# EAGLE design piezo-preamp-tickler_V3-5_single-supply-OPA1642 (EAGLE 8.2.2)

## Sheet 1 of 2
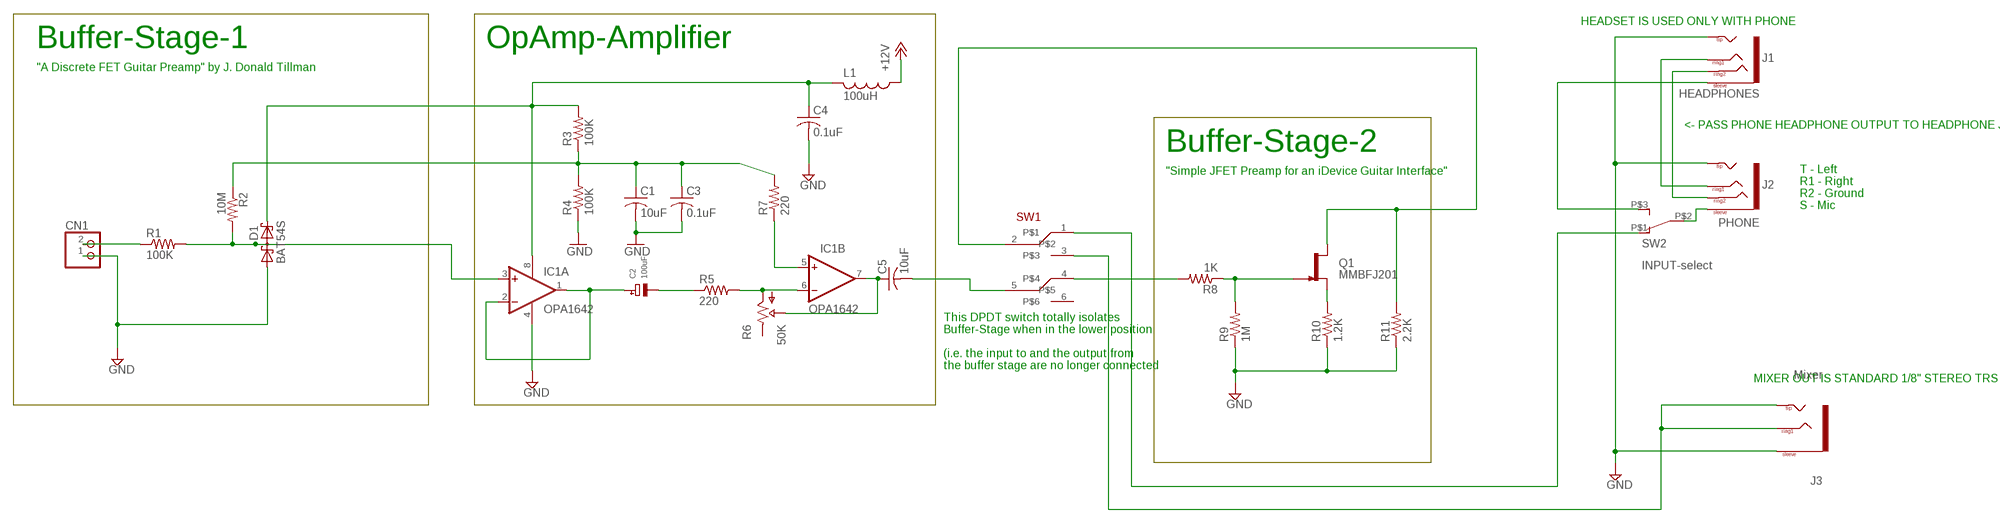
[diagram p0: schematic, sheet 1]

### Parts
C1  10uF  C-USC0805K  [C0805K]
C2  100uF  CAP_TANTALUMA/3216_REFLOW  [EIA3216-18/A-R]
C3  0.1uF  C-USC0805K  [C0805K]
C4  0.1uF  C-USC0805K  [C0805K]
C5  10uF  C-USC0805  [C0805]
CN1  JST_2PIN-THM  [JST-PH-2-THM]
D1  BAT54S  [SOT23]
IC1  OPA1642  OPA2134UA  [SO08]
J1  HEADPHONES  TRRS-1/8"-3.5MMLGPADS  [TRRS_SJ-43514-SMT-TR]
J2  PHONE  TRRS-1/8"-3.5MMLGPADS  [TRRS_SJ-43514-SMT-TR]
J3  Mixer  TRS-1/8"-3.5MM  [TRS_SJ-3524-SMT]
L1  100uH  L-USL3225P  [L3225P]
Q1  MMBFJ201  J201SOT-23  [SOT23-3]
R1  100K  R-US_R0603  [R0603]
R2  10M  R-US_R0603  [R0603]
R3  100K  R-US_R0603  [R0603]
R4  100K  R-US_R0603  [R0603]
R5  220  R-US_R0603  [R0603]
R6  50K  POTPOT-THUMB-ALPHA  [POT-THUMB-14MM_ALPHA-RV100F-30-4K1B-B10K-B301]
R7  220  R-US_R0603  [R0603]
R8  1K  R-US_R0603  [R0603]
R9  1M  R-US_R0603  [R0603]
R10  1.2K  R-US_R0603  [R0603]
R11  2.2K  R-US_R0603  [R0603]
SW1  SWITCH_DPDT  [SWITCH_DPDT_CL-SB-22B]
SW2  INPUT-select  SWITCH_SPDTCL-SB-12B  [SWITCH_SPDT_CL-SB-12B]

### Nets
+12V: L1.1 ; also sheet 2
GND: C1.2 C3.2 C4.2 CN1.1 D1.1(A1) IC1.4(A:V-) J1.TIP J2.TIP J3.1(SLEEVE) R4.1 R9.1 R10.1 R11.1 ; also sheet 2
N$2: CN1.2 R1.1
N$3: Q1.2(S) R10.2
N$4: J1.EARTH(SLEEVE)
N$5: IC1.5(B:+IN) R7.1
N$6: C5.1 IC1.7(B:OUT) R6.P$2(WIPER)
N$7: IC1.6(B:-IN) R5.2 R6.P$1(IN)
N$9: D1.3(C1A2) IC1.3(A:+IN) R1.2 R2.2
N$10: Q1.3(G) R8.1 R9.2
N$11: R8.2 SW1.4
N$12: J3.2(TIP) J3.3(RING1) J3.4(TIP) SW1.3
N$13: J1.RING1 J2.RING1
N$14: C2.- R5.1
N$15: J1.RING2 J2.RING2
N$16: C5.2 SW1.5
N$17: J2.EARTH(SLEEVE) SW2.P$2
N$19: SW1.1 SW2.P$1
N$23: C1.1 C3.1 R2.1 R3.1 R4.2 R7.2
N$24: C2.+ IC1.1(A:OUT) IC1.2(A:-IN)
N$25: C4.1 D1.2(C2) IC1.8(A:V+) L1.2 R3.2
SELECT: Q1.1(D) R11.2 SW1.2
Unconnected: R6.P$3(OUT) SW1.6 SW2.P$3

### Notes on the sheet
- HEADSET IS USED ONLY WITH PHONE
- Buffer-Stage-1 | OpAmp-Amplifier
- "A Discrete FET Guitar Preamp" by J. Donald Tillman
- <- PASS PHONE HEADPHONE OUTPUT TO HEADPHONE JACK
- Buffer-Stage-2
- "Simple JFET Preamp for an iDevice Guitar Interface"
- T - Left
  R1 - Right
  R2 - Ground
  S - Mic
- This DPDT switch totally isolates 
  Buffer-Stage when in the lower position
  
  (i.e. the input to and the output from 
  the buffer stage are no longer connected
- MIXER OUT IS STANDARD 1/8" STEREO TRS

## Sheet 2 of 2
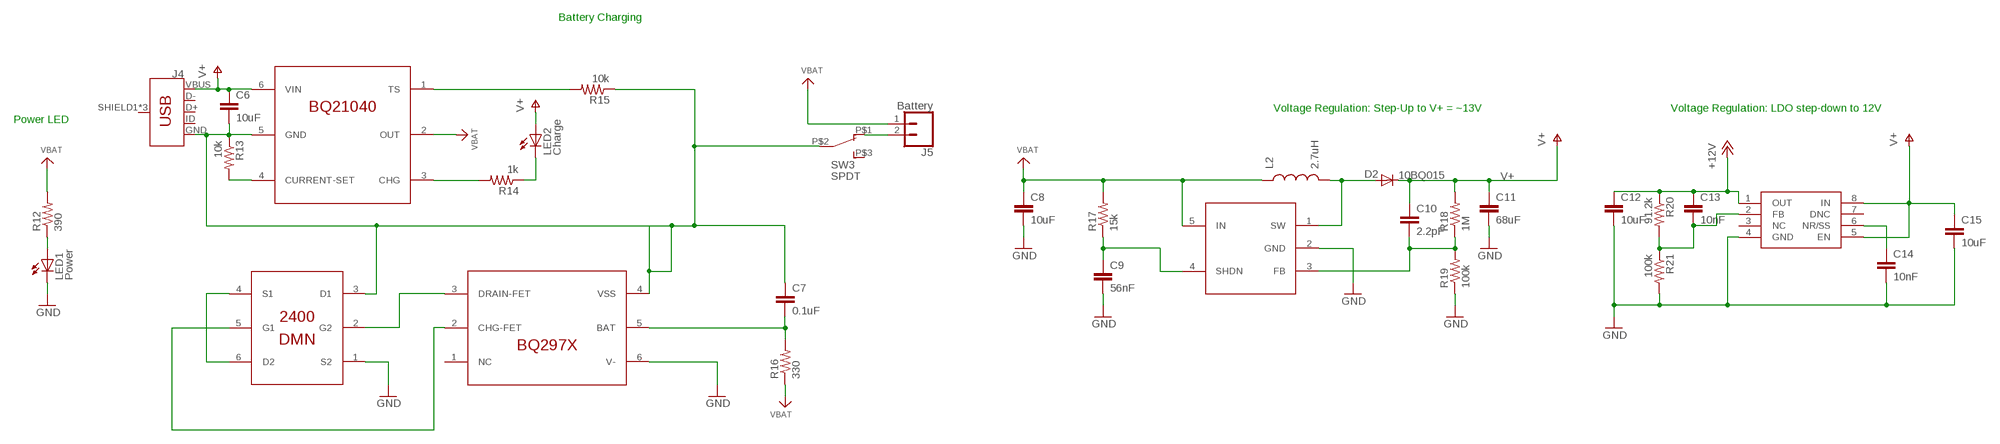
[diagram p1: schematic, sheet 2]

### Parts
C6  10uF  C-EUC0603  [C0603]
C7  0.1uF  C-EUC0603  [C0603]
C8  10uF  C-EUC0603  [C0603]
C9  56nF  C-EUC0603  [C0603]
C10  2.2pF  C-EUC0603  [C0603]
C11  68uF  C-EUC1206  [C1206]
C12  10uF  C-EUC0603  [C0603]
C13  10nF  C-EUC0603  [C0603]
C14  10nF  C-EUC0603  [C0603]
C15  10uF  C-EUC0603  [C0603]
D2  10BQ015  DIODESMA  [SMA-DIODE]
IC2  DMN2400  DUAL-NFET-DMN2400  [SOT-563]
IC3  BQ21040  BQ21040-LIPO-CHARGER  [SOT23-6]
IC4  BQ297X  BQ297X-BATTERY-MANAGER  [WSON-6]
IC5  SC4503  [SOT23-5]
IC6  TPS7A49  [MSOP-8]
J4  USB_MICRO-BREDUCED_PASTE  [USB-B-MICRO-SMD_RED_PASTE]
J5  Battery  CONN_02LOCK  [1X02_LOCK]
L2  2.7uH  INDUCTORCR54  [CR54]
LED1  Power  LED3MM  [LED3MM]
LED2  Charge  LED3MM  [LED3MM]
R12  390  R-US_R0603  [R0603]
R13  10k  R-US_R0603  [R0603]
R14  1k  R-US_R0603  [R0603]
R15  10k  R-US_R0603  [R0603]
R16  330  R-US_R0603  [R0603]
R17  15k  R-US_R0603  [R0603]
R18  1M  R-US_R0603  [R0603]
R19  100k  R-US_R0603  [R0603]
R20  91.2k  R-US_R0603  [R0603]
R21  100k  R-US_R0603  [R0603]
SW3  SPDT  SWITCH_SPDTCL-SB-12B  [SWITCH_SPDT_CL-SB-12B]

### Nets
+12V: C12.1 C13.1 IC6.1(OUT) R20.1 ; also sheet 1
GND: C8.2 C9.2 C11.2 C12.2 C14.2 C15.2 IC2.1(S2) IC4.6(V-) IC5.2(GND) IC6.4(GND) LED1.K(C) R19.1 R21.2 ; also sheet 1
GND2: C6.2 C7.1 IC2.3(D1) IC3.5(GND) IC4.4(VSS) J4.GND R13.1 R15.1 SW3.P$2
N$18: LED1.A R12.1
N$20: J5.2 SW3.P$1
N$22: LED2.K(C) R14.1
N$26: C13.2 IC6.2(FB) R20.2 R21.1
N$27: IC3.3(CHG) R14.2
N$28: C14.1 IC6.6(NR/SS)
N$29: C9.1 IC5.4(SHDN) R17.1
N$30: C10.2 IC5.3(FB) R18.1 R19.2
N$31: IC3.1(TS) R15.2
N$32: D2.A IC5.1(SW) L2.P$2
N$36: IC3.4(CURRENT-SET) R13.2
N$42: C7.2 IC4.5(BAT) R16.2
N$43: IC2.4(S1) IC2.6(D2)
N$44: IC2.5(G1) IC4.2(CHG-FET)
N$45: IC2.2(G2) IC4.3(DRAIN-FET)
V+: C6.1 C10.1 C11.1 C15.1 D2.C IC3.6(VIN) IC6.5(EN) IC6.8(IN) J4.VBUS LED2.A R18.2
VBAT: C8.1 IC3.2(OUT) IC5.5(IN) J5.1 L2.P$1 R12.2 R16.1 R17.2
Unconnected: IC4.1(NC) IC6.3(NC) IC6.7(DNC) J4.D+ J4.D- J4.ID J4.SHIELD1(SHIELD) J4.SHIELD2(SHIELD) J4.SHIELD3(SHIELD) SW3.P$3

### Notes on the sheet
- Battery Charging
- Voltage Regulation: Step-Up to V+ = ~13V | Voltage Regulation: LDO step-down to 12V
- Power LED

## Library data of the parts
C1 C3-C5 = adafruit:C-US: CAPACITOR, American symbol
C2 = microbuilder:CAP_TANTALUM: Tantalum Capacitors Wave footprints have larger pads and are meant to be used for hand soldering. Reflow footprints are optimised for solder paste and a reflow oven. EIA3216-18/A-[R/W] - Size A / 3216-18 / 1206 footprint 4.7µF 25V 10% Tantalum Capacitor 10µF 16V 10% Tantalum Capacitor [Digikey: 495-2236-2-ND] EIA3528-21/B-[R/W] - Size B / 3528-21 47µF 10V 10% Tantalum Capactior [Digikey: 495-2216-1-ND] EIA6032-28/C-[R/W] - Size C / 6032-28 10µF 35V 20% Tantalum Capacitor [Digikey: 495-2285-1-ND] 100µF 16V 10% Tantalum Capactior [Digikey: 399-5214-1-ND]
C6-C15 = rcl:C-EU: CAPACITOR, European symbol; SPICEPREFIX: C
CN1 = adafruit:JST_2PIN: JST 2-Pin Connectors of various flavors SMT-RA (S2B-PH-SM4) 4UConnector #17311 SMT (B2B-PH-SM4) THM-RA (S2B-PH) THM (B2B-PH)
D1 = diode:BAT54S: Schottky Diodes Pin connection corrected 2011-05-04 Source: Fairchild .. BAT54.pdf
D2 = SparkFun:DIODE: Diode These are standard reverse protection diodes and small signal diodes. SMA package can handle up to about 1A. SOD-323 can handle about 200mA. What the SOD-323 package when ordering, there are some mfgs out there that are 5-pin packages.
IC1 = linear:OPA2*: Dual Operational Amplifier Low Power, Single-Supply, Rail-To-Rail Operational Amplifier Source: http://focus.ti.com/lit/ds/symlink/opa2345.pdf http://focus.ti.com .. opa241.pdf http://focus.ti.com/lit/ds/symlink/opa2134.pdf
IC2 = CMU-ArtFab:DUAL-NFET-DMN2400
IC3 = CMU-ArtFab:BQ21040-LIPO-CHARGER
IC4 = CMU-ArtFab:BQ297X-BATTERY-MANAGER
IC5 = CMU-ArtFab:SC4503
IC6 = CMU-ArtFab:TPS7A49
J1 J2 = CMU-ArtFab:TRRS-1/8"-3.5MM: Audio jack - 3.5mm TRRS variety - two rings.
J3 = CMU-ArtFab:TRS-1/8"-3.5MM
J4 = SparkFun-Connectors:USB_MICRO-B: USB Type Micro-B Connector Male/female and PTH/SMT variants SparkFun Products: SparkFun microB USB Breakout <https://www.sparkfun.com/products/12035> SparkFun USB microB Plug Breakout <https://www.sparkfun.com/products/10031> SparkFun ESP8266 Thing <https://www.sparkfun.com/products/13231>; PROD_ID: CONN-11752
J5 = SparkFun-Connectors:CONN_02: Multi connection point. Often used as Generic Header-pin footprint for 0.1 inch spaced/style header connections On any of the 0.1 inch spaced packages, you can populate with these: Break Away Headers - Straight <https://www.sparkfun.com/products/116> (PRT-00116) Break Away Male Headers - Right Angle <https://www.sparkfun.com/products/553> (PRT-00553) Female Headers <https://www.sparkfun.com/products/115> (PRT-00115) Break Away Headers - Machine Pin <https://www.sparkfun.com/products/117> (PRT-00117) Break Away Female Headers - Swiss Machine Pin <https://www.sparkfun.com/products/743> (PRT-00743) For SCREWTERMINALS and SPRING TERMINALS visit here: Screw Terimnals on SparkFun.com <https://www.sparkfun.com/search/results?term=Screw+Terminals> (5mm/3.5mm/2.54mm spacing) This device is also useful as a general connection point to wire up your design to another part of your project. Our various solder wires solder well into these plated through hole pads. Hook-Up Wire - Assortment (Stranded, 22 AWG) <https://www.sparkfun.com/products/11375> (PRT-11375) Hook-Up Wire - Assortment (Solid Core, 22 AWG) <https://www.sparkfun.com/products/11367> (PRT-11367) View the entire wire category on our website here <https://www.sparkfun.com/categories/141> Special notes: Molex polarized connector foot print use with: PRT-08233 with associated crimp pins and housings. 2.54_SCREWTERM for use with PRT-10571. 3.5mm Screw Terminal footprints for PRT-08084 5mm Screw Terminal footprints for use with PRT-08432
L1 = rcl:L-US: INDUCTOR, American symbol; SPICEPREFIX: L
L2 = SparkFun-Passives:INDUCTOR: Inductors Basic Inductor/Choke - 0603 and 1206. Footprints are not proven and vary greatly between part numbers. SRN6045- 33uH, 20% 1.4A SDR0403-560KL - 56uH, 10%, 500mA RMS/740mA peak
LED1 LED2 = led:LED: LED OSRAM: - CHIPLED LG R971, LG N971, LY N971, LG Q971, LY Q971, LO R971, LY R971 LH N974, LH R974 LS Q976, LO Q976, LY Q976 LO Q996 - Hyper CHIPLED LW Q18S LB Q993, LB Q99A, LB R99A - SideLED LS A670, LO A670, LY A670, LG A670, LP A670 LB A673, LV A673, LT A673, LW A673 LH A674 LY A675 LS A676, LA A676, LO A676, LY A676, LW A676 LS A679, LY A679, LG A679 - Hyper Micro SIDELED® LS Y876, LA Y876, LO Y876, LY Y876 LT Y87S - SmartLED LW L88C, LW L88S LB L89C, LB L89S, LG L890 LS L89K, LO L89K, LY L89K LS L896, LA L896, LO L896, LY L896 - TOPLED LS T670, LO T670, LY T670, LG T670, LP T670 LSG T670, LSP T670, LSY T670, LOP T670, LYG T670 LG T671, LOG T671, LSG T671 LB T673, LV T673, LT T673, LW T673 LH T674 LS T676, LA T676, LO T676, LY T676, LB T676, LH T676, LSB T676, LW T676 LB T67C, LV T67C, LT T67C, LS T67K, LO T67K, LY T67K, LW E67C LS E67B, LA E67B, LO E67B, LY E67B, LB E67C, LV E67C, LT E67C LW T67C LS T679, LY T679, LG T679 LS T770, LO T770, LY T770, LG T770, LP T770 LB T773, LV T773, LT T773, LW T773 LH T774 LS E675, LA E675, LY E675, LS T675 LS T776, LA T776, LO T776, LY T776, LB T776 LHGB T686 LT T68C, LB T68C - Hyper Mini TOPLED® LB M676 - Mini TOPLED Santana® LG M470 LS M47K, LO M47K, LY M47K Source: http://www.osram.convergy.de LUXEON: - LUMILED® LXK2-PW12-R00, LXK2-PW12-S00, LXK2-PW14-U00, LXK2-PW14-V00 LXK2-PM12-R00, LXK2-PM12-S00, LXK2-PM14-U00 LXK2-PE12-Q00, LXK2-PE12-R00, LXK2-PE12-S00, LXK2-PE14-T00, LXK2-PE14-U00 LXK2-PB12-K00, LXK2-PB12-L00, LXK2-PB12-M00, LXK2-PB14-N00, LXK2-PB14-P00, LXK2-PB14-Q00 LXK2-PR12-L00, LXK2-PR12-M00, LXK2-PR14-Q00, LXK2-PR14-R00 LXK2-PD12-Q00, LXK2-PD12-R00, LXK2-PD12-S00 LXK2-PH12-R00, LXK2-PH12-S00 LXK2-PL12-P00, LXK2-PL12-Q00, LXK2-PL12-R00 Source: www.luxeon.com KINGBRIGHT: KA-3528ASYC Source: www.kingbright.com
Q1 = CMU-ArtFab:J201: N-channel JFET
R1-R5 R7-R21 = CMU-ArtFab:R-US_: RESISTOR, American symbol
R6 = CMU-ArtFab:POT: http://www.taydaelectronics.com/10k-ohm-linear-taper-potentiometer-round-shaft-pcb-9mm.html http://www.taydaelectronics.com/datasheets/A-1847.pdf
SW1 = CMU-ArtFab:SWITCH_DPDT
SW2 SW3 = CMU-ArtFab:SWITCH_SPDT

## Board
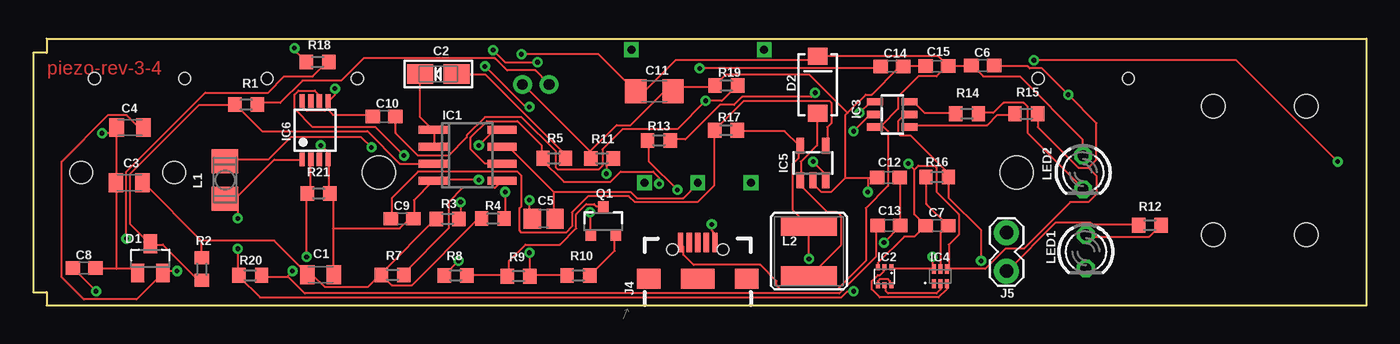
[diagram p2: board, top side]
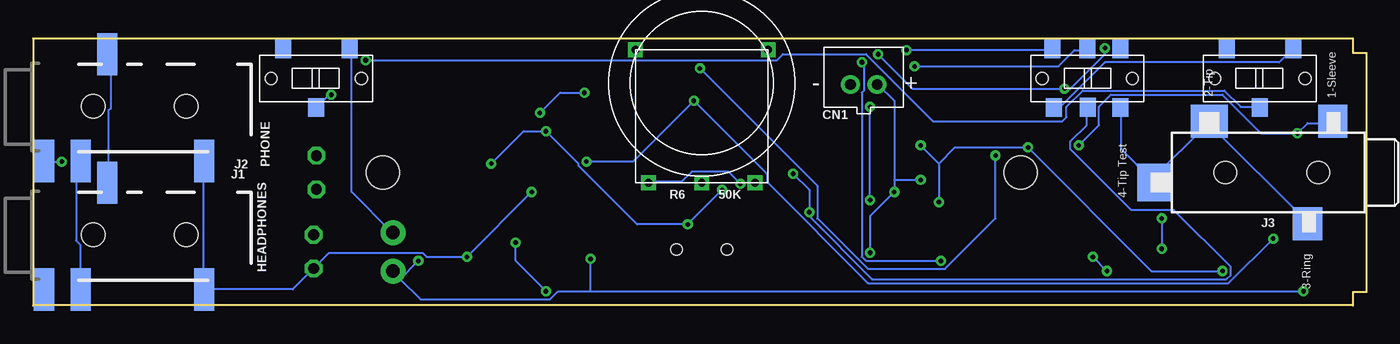
[diagram p3: board, bottom side, seen from below]

Size 100.3 x 20.07 mm. Coordinates in mm from the lower left corner, seen from the top.
Outline: 0,19 0,1 1.02,1 1.02,0 100.3,0 100.3,20.07 1,20.07 1,19 0,19
Copper layers (1*16): Top 0.035mm / dielectric 1.5mm / Bottom 0.035mm
Design rules "default *": minimum track width 6mil, minimum drill 0.35mm, track to track 6mil, track to pad 6mil, pad to pad 6mil, via to via 6mil, smd to smd 6mil, copper to edge 8mil, drill to drill 6mil, minimum pad ring 10mil, minimum via ring 8mil, stop-mask expansion 4mil, vias tented up to drill 20mil, thermal gap 10mil
Holes 2.5 mm at 74,10 26,10

### Footprints (pad centres in the part's own frame; a part is rotated, then mirrored left to right if it is on the bottom)
C0805K = smd 1.1 x 1.4: 1 -1,0; 2 1,0
EIA3216-18/A-R = smd 1.95 x 1.5: + 1.375,0; - -1.375,0
C0805 = smd 1.3 x 1.5: 1 -0.85,0; 2 0.85,0
C0603 = smd 1.1 x 1: 1 -0.85,0; 2 0.85,0
C1206 = smd 1.6 x 1.8: 1 -1.4,0; 2 1.4,0
JST-PH-2-THM = drill 0.8 pad 1.422: 1 1,0; 2 -1,0
SOT23 = smd 1 x 1.4: 1 -0.95,-1.1; 2 0.95,-1.1; 3 0,1.1
SMA-DIODE = smd 1.27 x 1.47: A -2.15,0; C 2.15,0
SO08 = smd 0.6 x 2.2: 1 -1.905,-2.6; 2 -0.635,-2.6; 3 0.635,-2.6; 4 1.905,-2.6; 5 1.905,2.6; 6 0.635,2.6; 7 -0.635,2.6; 8 -1.905,2.6
SOT-563 = smd 0.3 x 0.45: 1 -0.5,-0.675; 2 0,-0.675; 3 0.5,-0.675; 4 0.5,0.675; 5 0,0.675; 6 -0.5,0.675
SOT23-6 = smd 0.55 x 1.2: 1 -0.95,-1.3; 2 0,-1.3; 3 0.95,-1.3; 4 0.95,1.3; 5 0,1.3; 6 -0.95,1.3
WSON-6 = smd 0.3 x 0.7: 1 -0.5,-0.55; 2 0,-0.55; 3 0.5,-0.55; 4 0.5,0.55; 5 0,0.55; 6 -0.5,0.55
SOT23-5 = smd 0.55 x 1.2: 1 -0.95,-1.3; 2 0,-1.3; 3 0.95,-1.3; 4 0.95,1.3; 5 -0.95,1.3
MSOP-8 = smd 0.4 x 1: 1 -0.975,-2.2; 2 -0.325,-2.2; 3 0.325,-2.2; 4 0.975,-2.2; 5 0.975,2.2; 6 0.325,2.2; 7 -0.325,2.2; 8 -0.975,2.2
TRRS_SJ-43514-SMT-TR = smd 1.524 x 3.175: EARTH -7.067,-4.128; RING1 -2.309,3.901; RING2 -4.293,-4.128; TIP 4.995,-4.128 | hole 1.778: -3.353,-0.007; 3.647,-0.007
TRS_SJ-3524-SMT = smd 2.5 x 2.2: 1 3.85,-4.6; 3 -3.85,-2.7 | smd 2.5 x 2.8: 2 3.85,4.7 | smd 2.8 x 2.5: 4 -0.75,8.85 | hole 1.7: 0,-3.5; 0,3.5
USB-B-MICRO-SMD_RED_PASTE = smd 1.45 x 0.4: D+ 2.725,0; D- 2.725,0.65; GND 2.725,-1.3; ID 2.725,-0.65; VBUS 2.725,1.3 | smd 1.5 x 1.8: SHIELD1 0,3.685; SHIELD2 0,-3.685 | smd 1.5 x 2.5: SHIELD3 0,0 | hole 0.85: 2.2,1.9; 2.2,-1.9
1X02_LOCK = drill 1.016 pad 1.88: 1 -0.178,0; 2 2.718,0
L3225P = smd 1.8 x 2: 1 -1.4,0; 2 1.4,0
CR54 = smd 4.2 x 1.4: P$1 0,1.85; P$2 0,-1.85
LED3MM = drill 0.813 octagon: A -1.27,0; K 1.27,0
SOT23-3 = smd 0.8 x 0.9: 1 -0.95,-1; 2 0.95,-1; 3 0,1.1
R0603 = smd 1 x 1.1: 1 -0.85,0; 2 0.85,0
POT-THUMB-14MM_ALPHA-RV100F-30-4K1B-B10K-B301 = drill 0.6 square: P$1 -4,-7.5; P$2 0,-7.5; P$3 4,-7.5; P$4 -5,2.5; P$5 5,2.5
SWITCH_DPDT_CL-SB-22B = smd 1.2 x 1.4: 1 -2.5,-2.2; 2 0.05,-2.17; 3 2.5,-2.2; 4 -2.63,2.2; 5 0,2.2; 6 2.51,2.2 | hole 0.9: -3.4,0; 3.4,0
SWITCH_SPDT_CL-SB-12B = smd 1.2 x 1.4: P$1 -2.5,-2.2; P$2 0,2.2; P$3 2.5,-2.2 | hole 0.9: -3.4,0; 3.4,0

### Placement (x,y rotation side)
C1  21.62,2.31 0 top
C2  30.48,17.41 180 top
C3  7.23,9.23 180 top
C4  7.29,13.38 180 top
C5  38.41,6.53 180 top
C6  71.44,18.04 0 top
C7  68,6 0 top
C8  3.83,2.81 0 top
C9  27.76,6.52 0 top
C10  26.41,14.21 0 top
C11  46.73,16.1 0 top
C12  64.35,9.63 180 top
C13  64.39,6.02 180 top
C14  64.62,17.98 0 top
C15  68,18 180 top
CN1  37.81,16.62 0 bottom
D1  8.81,3.54 0 top
D2  59.04,16.61 90 top
IC1  32.68,11.3 270 top
IC2  64.06,2.19 180 top
IC3  64.64,14.37 90 top
IC4  68.25,2.19 0 top
IC5  58.67,10.72 0 top
IC6  21.21,13.18 0 top
J1  92.43,5.33 0 bottom
J2  92.43,14.99 0 bottom
J3  7.11,10 90 bottom
J4  50,2.02 90 top
J5  73.23,2.75 90 top
L1  14.44,9.44 90 top
L2  58.37,4.09 0 top
LED1  79.2,4.05 270 top
LED2  79,10 270 top
Q1  42.9,6.3 0 top
R1  16.03,15.11 180 top
R2  12.68,2.74 270 top
R3  31.18,6.51 0 top
R4  34.58,6.54 180 top
R5  39.2,11.07 180 top
R6  50,16.73 0 bottom
R7  27.04,2.31 180 top
R8  31.78,2.26 180 top
R9  36.52,2.2 180 top
R10  41.02,2.24 0 top
R11  42.79,11.07 0 top
R12  84.02,6.03 180 top
R13  47.08,12.41 0 top
R14  70.26,14.42 180 top
R15  74.72,14.41 180 top
R16  68.01,9.66 180 top
R17  52.13,13.18 0 top
R18  21.39,18.31 180 top
R19  52.15,16.54 0 top
R20  16.34,2.27 0 top
R21  21.47,8.42 0 top
SW1  21,17.08 0 bottom
SW2  8,17.08 180 bottom
SW3  79,17.08 180 bottom

### Tracks (layer width: path | path; a pad name or v marks a point on that pad's centre or on a via)
+12V  (via drill 0.35)
  Top 0.152: C12.1 65.23,9.6 65.23,6.1 C13.1 65.23,5.94 v64.01,4.72 | 15.39,8.23 15.24,8.08 14.48,8.08 L1.1 15.39,8.23 | 15.39,8.23 18.14,10.97 20.12,10.97 IC6.1 | v15.39,4.27 15.39,2.29 R20.1 15.54,2.13 17.07,0.61 60.81,0.61 61.27,1.07 v61.72,1.07 | 15.39,8.23 v15.39,6.55
  Bottom 0.152: v15.39,6.55 v15.39,4.27 | v64.01,4.72 64.01,3.35 v61.72,1.07
GND  (via drill 0.35)
  Top 0.152: 67.67,2.74 64.62,2.74 IC2.1 | v67.67,3.66 67.67,2.74 | 67.67,2.74 IC4.6 | 6.25,2.74 7.62,2.74 7.77,2.59 D1.1 | 6.25,2.74 4.72,2.74 C8.2 | 6.25,12.95 6.25,13.26 C4.2 6.25,12.95 | 6.25,12.95 6.25,9.3 C3.2 6.25,9.14 6.25,2.74 | 6.25,12.95 v5.18,12.95 | 22.55,5.79 22.55,8.23 22.4,8.38 R21.2 22.25,8.53 22.25,10.97 IC6.4 22.1,11.12 22.1,11.58 v21.64,12.04 | 22.55,5.79 22.55,2.44 C1.2 | 22.55,5.79 27.58,5.79 28.19,6.4 28.5,6.4 C9.2 28.65,6.55 28.65,7.92 30.02,9.3 IC1.4 30.18,9.45 v33.53,9.45 | C15.2 67.06,17.98 65.53,17.98 C14.2 65.38,17.83 65.08,17.83 63.09,15.85 62.64,15.85 61.27,14.48 | 61.11,9.6 62.79,9.6 | 62.79,9.6 63.4,9.6 C12.2 | 61.11,9.6 60.05,8.53 59.28,8.53 58.52,9.3 IC5.2 | 61.27,14.48 61.11,14.33 61.11,9.6 | R10.1 40.08,2.29 37.49,2.29 R9.1 37.34,2.29 v37.34,3.96 | v35.51,8.53 35.51,6.55 R4.1 | 41.91,11.58 41.91,11.12 R11.1 41.91,11.58 | 41.91,11.58 36.88,16.61 CN1.1 | 41.91,11.58 43.89,13.56 44.96,13.56 47.4,16 48.01,16 C11.2 48.16,16.15 48.46,16.46 51.21,16.46 R19.1 51.36,16.61 52.12,17.37 58.37,17.37 61.27,14.48 | 62.79,9.6 v62.79,8.53
  Bottom 0.152: J2.TIP 87.48,10.82 87.48,1.22 J1.TIP 87.33,1.22 80.77,1.22 79.25,2.74 LED1.K 79.1,2.9 78.03,3.96 71.02,3.96 70.71,3.66 v67.67,3.66 v62.79,8.53 | J3.1 2.59,13.72 4.42,13.72 v5.18,12.95 7.92,12.95 10.82,15.85 19.2,15.85 20.12,14.94 20.12,13.56 v21.64,12.04 | 35.51,9.45 35.51,15.39 36.73,16.61 CN1.1 | 35.51,9.45 v35.51,8.53 37.34,6.71 v37.34,3.96 | 35.51,9.45 v33.53,9.45
GND2  (via drill 0.35)
  Top 0.152: v48.46,8.69 46.33,10.82 46.33,12.34 R13.1 | v51.05,6.1 51.05,5.64 51.21,5.49 51.21,4.88 J4.GND | v61.72,13.11 62.94,14.33 63.25,14.33 IC3.5 | IC2.3 63.55,2.9 63.55,3.2 65.53,5.18 66.29,5.18 67.06,5.94 C7.1 67.06,6.1 66.29,6.86 66.29,10.21 | 68.89,2.74 68.89,4.57 69.65,5.33 69.65,6.86 67.97,8.53 67.97,10.36 67.82,10.52 66.6,10.52 66.29,10.21 | 79.4,10.36 80.01,10.97 80.01,13.72 v77.88,15.85 75.89,17.83 74.98,17.83 74.83,17.98 72.39,17.98 C6.2 | 79.4,10.36 78.64,10.36 75.59,13.41 75.59,14.33 R15.1 | 68.89,2.74 71.63,2.74 73.15,4.27 74.52,4.27 78.03,7.77 79.4,7.77 80.01,8.38 80.01,9.75 79.4,10.36 | 68.89,2.74 IC4.4 | 66.29,10.21 v65.84,10.67
  Bottom 0.152: v48.46,8.69 v51.05,6.1 54.86,6.1 59.28,10.52 59.28,10.67 v61.72,13.11 63.4,13.11 v65.84,10.67 | v77.88,15.85 78.03,15.85 78.94,14.94 SW3.P$2
N$2
  Top 0.152: R1.1 16.92,15.24 18.59,15.24 20.27,16.92 23.16,16.92 24.84,18.59 34.75,18.59 35.66,17.68 37.8,17.68 38.71,16.76 CN1.2
N$3
  Top 0.152: Q1.2 43.74,5.18 43.74,4.12 41.91,2.29 R10.2
N$5
  Top 0.152: R7.1 27.89,2.44 31.24,5.79 31.24,7.77 32.31,8.84 34.75,8.84 35.2,9.3 IC1.5
N$6
  Top 0.152: 39.17,8.53 39.17,6.55 C5.1 | 39.17,8.53 35.81,11.89 35.36,11.89 IC1.7 | 39.17,8.53 44.96,8.53 45.41,8.08 48.92,8.08 49.99,9.14 R6.P$2
N$7  (via drill 0.35)
  Top 0.152: IC1.6 35.2,10.67 33.98,10.67 32.92,11.73 32.92,12.65 34.14,13.87 36.42,13.87 38.25,12.04 38.25,11.12 R5.2 38.25,10.97 39.93,9.3 43.43,9.3 44.2,10.06 46.63,10.06 47.09,9.6 v47.09,9.14
  Bottom 0.152: v47.09,9.14 48.01,10.06 50.75,10.06 51.51,9.3 53.95,9.3 R6.P$1
N$9
  Top 0.152: R2.2 12.65,1.98 12.34,1.98 9.75,4.57 8.84,4.57 D1.3 8.69,4.72 7.32,6.1 7.32,9.91 12.5,15.09 15.09,15.09 R1.2 15.24,15.09 17.22,13.11 25.15,13.11 27.58,10.67 30.02,10.67 IC1.3
N$10
  Top 0.152: Q1.3 42.82,7.47 42.37,7.47 42.22,7.62 41.6,7.62 40.84,6.86 40.84,5.79 39.62,4.57 37.03,4.57 35.81,3.35 35.81,2.29 R9.2 35.66,2.29 32.77,2.29 R8.1
N$11  (via drill 0.35)
  Top 0.152: v32,3.35 30.94,2.29 R8.2 | v37.95,18.29 35.51,18.29 v34.59,19.2
  Bottom 0.152: v32,3.35 37.64,3.35 37.95,3.66 37.95,16 37.8,16.15 37.8,18.14 v37.95,18.29 | v34.59,19.2 23.77,19.2 SW1.4
N$12
  Bottom 0.152: 16.15,9.45 16,9.3 J3.4 16.15,9.45 | 16.15,9.45 18.44,11.73 18.44,14.78 SW1.3 | 11.89,13.72 4.42,6.25 J3.3 | 11.89,13.72 16.15,9.45 | 11.89,13.72 J3.2
N$13
  Bottom 0.152: J1.RING1 94.64,9.3 94.64,14.63 94.49,14.78 94.49,18.59 94.64,18.75 J2.RING1
N$14
  Top 0.152: R5.1 39.93,11.12 39.93,11.43 33.98,17.37 32,17.37 C2.-
N$15
  Bottom 0.152: J1.RING2 96.77,1.22 96.77,4.57 97.08,4.88 97.08,10.52 96.77,10.82 J2.RING2
N$16  (via drill 0.35)
  Top 0.152: v33.98,17.98 37.03,14.94 v37.34,14.94 | v37.34,7.92 37.34,6.71 37.49,6.55 C5.2
  Bottom 0.152: v33.98,17.98 23.16,17.98 21.95,19.2 21.03,19.2 SW1.5 | v37.34,7.92 v37.34,14.94
N$17  (via drill 0.35)
  Top 0.152: v75.29,18.44 90.53,18.44 v98.15,10.82
  Bottom 0.152: v75.29,18.44 44.35,18.44 43.89,18.9 37.64,18.9 32.61,13.87 22.86,13.87 22.55,14.17 22.55,14.94 21.34,16.15 10.67,16.15 9.45,14.94 8.08,14.94 SW2.P$2 | v98.15,10.82 99.36,10.82 J2.EARTH
N$18
  Top 0.152: R12.1 84.73,5.94 83.97,5.18 79.25,5.18 LED1.A
N$19
  Bottom 0.152: SW1.1 23.47,14.94 23.01,14.94 19.66,18.29 6.55,18.29 5.64,19.2 SW2.P$1
N$20
  Bottom 0.152: SW3.P$1 76.35,19.2 76.35,8.53 73.3,5.49 J5.2
N$22
  Top 0.152: R14.1 71.17,14.48 72.24,14.48 73,15.24 74.52,15.24 74.83,14.94 74.83,12.95 78.94,8.84 LED2.K
N$23
  Top 0.152: 12.65,4.88 12.65,3.66 R2.1 | 12.65,4.88 8.38,9.14 C3.1 | R7.2 26.21,2.44 30.33,6.55 R3.1 | R4.2 33.68,6.4 33.38,6.4 28.5,1.52 26.98,1.52 26.21,2.29 R7.2 | R7.2 26.06,2.29 25.15,1.37 21.95,1.37 21.03,2.29 20.73,2.29 C1.1 20.57,2.44 18.14,4.88 12.65,4.88
N$24
  Top 0.152: C2.+ 29.11,17.37 29.11,14.17 30.02,13.26 IC1.1 30.18,13.11 30.18,12.04 IC1.2
N$25  (via drill 0.35)
  Top 0.152: C4.1 8.23,13.41 7.92,13.41 7.01,14.33 5.64,14.33 2.13,10.82 2.13,2.13 3.81,0.46 7.77,0.46 D1.2 9.91,2.59 v10.82,2.59 | v32.16,7.77 32.16,6.55 R3.2 | v33.53,12.04 34.59,13.11 35.2,13.11 IC1.8 | v25.45,11.89 24.69,12.65 19.36,12.65 17.68,10.97 14.48,10.97 L1.2
  Bottom 0.152: 32.16,10.67 v32.16,7.77 | v33.53,12.04 32.16,10.67 | 32.16,10.67 30.94,11.89 v25.45,11.89 16.15,2.59 v10.82,2.59
N$26  (via drill 0.35)
  Top 0.152: IC6.2 20.88,8.69 20.73,8.53 R21.1 20.57,8.38 v20.57,3.66 | 19.05,2.13 19.2,2.13 20.42,0.91 60.66,0.91 63.4,3.66 63.4,5.94 C13.2 | 19.05,2.13 17.22,2.13 R20.2 | 19.05,2.13 v19.51,2.59
  Bottom 0.152: v19.51,2.59 v20.57,3.66
N$27
  Top 0.152: R14.2 69.34,14.48 67.06,14.48 66.29,15.24 65.99,15.24 IC3.3
N$28  (via drill 0.35)
  Top 0.152: v27.89,11.28 25.76,13.41 21.03,13.41 19.66,14.78 19.66,15.85 19.96,16.15 21.18,16.15 21.49,15.85 21.49,15.39 IC6.6 | v50.14,17.83 63.7,17.83 C14.1
  Bottom 0.152: v27.89,11.28 27.89,6.55 31.7,2.74 37.49,2.74 41.3,6.55 41.3,8.99 v50.14,17.83
N$29
  Top 0.152: C9.1 26.98,6.55 26.98,8.08 28.96,10.06 36.42,10.06 36.73,9.75 36.73,7.47 36.58,7.32 36.58,5.64 36.73,5.49 40.08,5.49 40.54,5.94 40.54,7.01 41.76,8.23 44.81,8.23 45.26,7.77 49.99,7.77 51.21,8.99 51.21,13.11 R17.1 53.49,15.39 59.89,15.39 60.05,15.24 60.05,13.72 59.74,13.41 59.74,12.04 IC5.4
N$30  (via drill 0.35)
  Top 0.152: v7.01,5.03 7.01,10.06 12.95,16 17.68,16 18.9,17.22 21.03,17.22 22.1,18.29 R18.1 | R19.2 52.88,16.46 51.82,15.39 v50.6,15.39 48.46,13.26 44.35,13.26 42.82,11.73 42.82,10.52 42.52,10.21 39.47,10.21 39.32,10.36 39.32,11.58 36.73,14.17 33.98,14.17 32.61,12.8 32.61,12.65 31.24,11.28 28.96,11.28 27.28,12.95 27.28,14.17 C10.2 | v58.67,10.82 59.59,9.91 59.59,9.45 IC5.3
  Bottom 0.152: v7.01,5.03 10.36,1.68 37.49,1.68 45.11,9.3 45.11,9.91 v50.6,15.39 55.17,10.82 v58.67,10.82
N$31
  Top 0.152: R15.2 73.76,14.33 72.54,14.33 71.78,13.56 65.99,13.56 IC3.1
N$32
  Top 0.152: D2.A 58.98,14.33 58.98,12.04 57.76,10.82 57.76,9.45 IC5.1 57.76,9.3 57.76,8.99 59.74,7.01 60.5,7.01 60.81,6.71 60.81,4.57 58.52,2.29 L2.P$2
N$36  (via drill 0.35)
  Top 0.152: v58.83,16 58.52,15.7 53.34,15.7 52.73,15.09 51.66,15.09 49.07,12.5 48.01,12.5 R13.2 | v62.18,14.48 62.94,15.24 63.25,15.24 IC3.4
  Bottom 0.152: v58.83,16 60.66,16 v62.18,14.48
N$42
  Top 0.152: IC4.5 68.28,2.74 68.28,5.49 68.73,5.94 C7.2 68.73,6.1 67.21,7.62 67.21,9.6 R16.2
N$43
  Top 0.152: IC2.4 63.55,1.52 63.55,1.83 63.7,1.98 64.31,1.98 64.47,1.83 64.47,1.52 IC2.6
N$44
  Top 0.152: IC2.5 64.16,1.37 64.16,1.07 64.31,0.91 67.97,0.91 68.28,1.22 68.28,1.52 IC4.2
N$45
  Top 0.152: IC2.2 64.01,2.74 64.01,2.59 63.7,2.29 63.55,2.29 63.09,1.83 63.09,1.22 63.7,0.61 68.12,0.61 68.73,1.22 68.73,1.52 IC4.3
SELECT  (via drill 0.35)
  Top 0.152: v41.91,7.01 41.91,5.33 Q1.1 | v43.13,9.91 43.13,10.52 43.59,10.97 R11.2
  Bottom 0.152: v43.13,9.91 41.91,8.69 v41.91,7.01 41.91,6.71 37.19,1.98 10.52,1.98 10.21,2.29 10.21,2.9 14.48,7.16 17.68,7.16 22.25,11.73 22.25,12.34 21.03,13.56 21.03,14.78 SW1.2
V+  (via drill 0.35)
  Top 0.152: 22.1,14.78 21.95,14.63 20.57,14.63 20.27,14.94 20.27,15.24 IC6.8 | 22.1,14.78 22.1,15.24 IC6.5 22.25,15.39 22.71,15.85 v22.71,16.31 | 22.1,14.78 22.55,14.33 25.45,14.33 C10.1 | v19.66,19.36 19.66,19.2 20.42,18.44 R18.2 | C15.1 68.89,17.98 70.56,17.98 C6.1 70.71,17.98 71.48,17.22 74.22,17.22 78.94,12.5 78.94,11.28 LED2.A | 63.86,13.56 63.4,13.56 IC3.6 63.86,13.56 | 63.86,13.56 65.08,14.78 65.08,15.7 66.6,17.22 67.97,17.22 68.73,17.98 C15.1 | 63.86,13.56 64.31,13.11 64.31,8.99 62.64,7.32 62.64,3.35 60.5,1.22 56.24,1.22 55.93,1.52 55.93,1.83 54.71,3.05 49.68,3.05 48.92,3.81 48.92,4.42 48.77,4.57 48.77,4.72 J4.VBUS | C15.1 68.73,18.14 68.12,18.75 59.13,18.75 D2.C 58.98,18.75 58.67,18.44 48.31,18.44 46.02,16.15 45.41,16.15 C11.1 45.26,16.15 42.52,18.9 v36.73,18.9
  Bottom 0.152: v19.66,19.36 19.66,18.9 22.25,16.31 v22.71,16.31 34.14,16.31 v36.73,18.9
VBAT  (via drill 0.35)
  Top 0.152: R17.2 53.03,13.11 56.54,13.11 57.61,12.04 IC5.5 57.61,11.89 57.61,11.12 57.15,10.67 57.15,7.16 L2.P$1 58.37,5.79 v58.37,3.5 | IC3.2 65.84,14.33 65.53,14.33 65.08,13.87 65.08,12.95 65.23,12.8 65.99,12.8 68.73,10.06 68.73,9.75 R16.1 68.89,9.6 68.89,8.08 71.32,5.64 v71.32,3.35 | v4.72,1.07 3.05,2.74 C8.1 | R12.2 83.06,6.1 79.7,6.1 79.55,6.25 76.96,6.25 73.3,2.59 J5.1
  Bottom 0.152: 58.37,1.07 60.81,1.07 61.42,0.46 71.17,0.46 72.69,1.98 | 58.37,1.07 v4.72,1.07 | 72.69,1.98 73.15,2.44 J5.1 72.69,1.98 | 72.69,1.98 v71.32,3.35 | 58.37,1.07 v58.37,3.5

### Text on the board
Top: piezo-rev-3-4